# Altium schematic sheet Connectors.SchDoc: Hrafn-Connectors
size Tabloid; DocumentNumber: Hrafn; Revision: 1
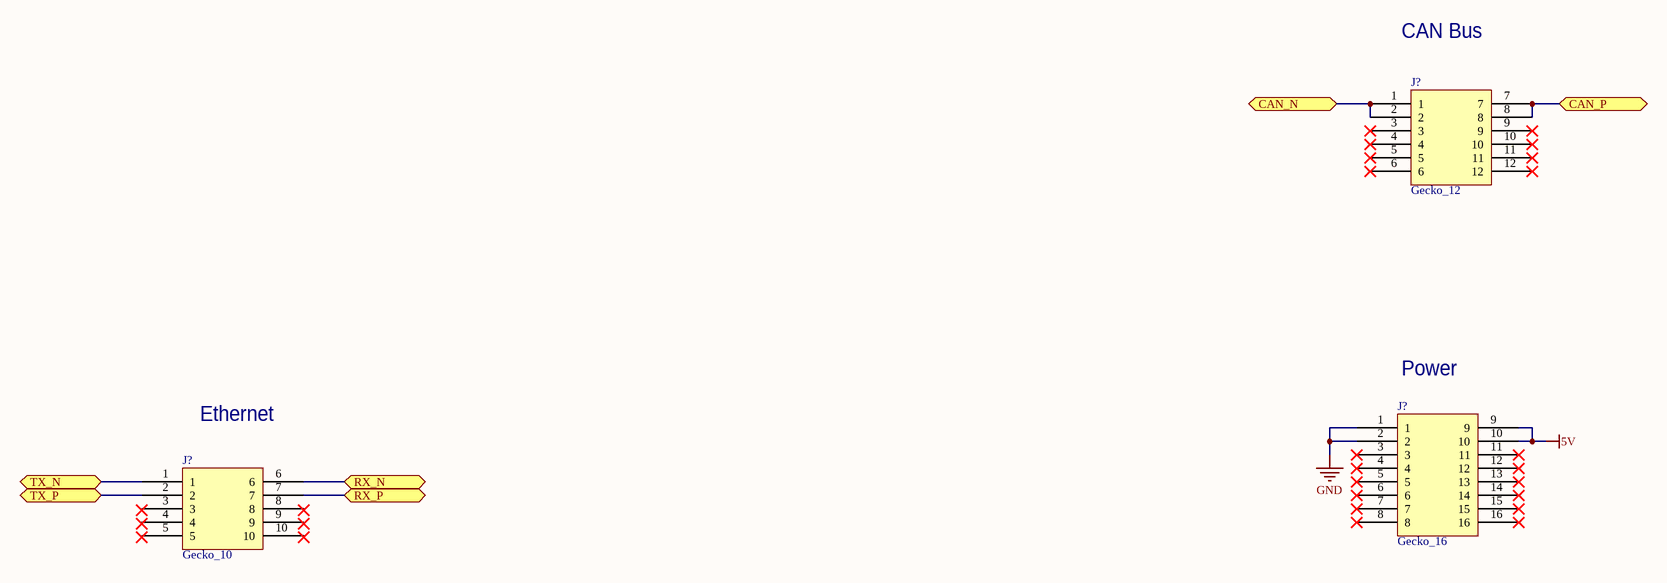
[diagram p0: Connectors.SchDoc]

## Parts
(Parts that share a designator on the sheet are numbered #1, #2 ... from top to bottom, then left to right.)
J?#1  Gecko_12
J?#2  Gecko_16
J?#3  Gecko_10

## Ports
CAN_N (bidir), CAN_P (bidir), RX_N (bidir), RX_P (bidir), TX_N (bidir), TX_P (bidir)

## Nets
5V: J?#2.9 J?#2.10
GND: J?#2.1 J?#2.2
CAN_N: J?#1.1 J?#1.2 ; port CAN_N
CAN_P: J?#1.7 J?#1.8 ; port CAN_P
RX_N: J?#3.6 ; port RX_N
RX_P: J?#3.7 ; port RX_P
TX_N: J?#3.1 ; port TX_N
TX_P: J?#3.2 ; port TX_P

Not connected (* = marked no-connect by the designer): J?#1 3* 4* 5* 6* 9* 10* 11* 12*; J?#2 3* 4* 5* 6* 7* 8* 11* 12* 13* 14* 15* 16*; J?#3 3 4 5 8 9 10

## Notes on the sheet
- CAN Bus
- (near J?#2) Power
- Ethernet
- Title
- Size
- Date
- Tabloid
- DCN
- Time
- Sheet
- of
- Revision
- Drawn
- 33-207 / 77 Mass. Ave.
- Cambridge, MA 02139
- File